# Altium schematic sheet FPGA_parts.SchDoc
size A4
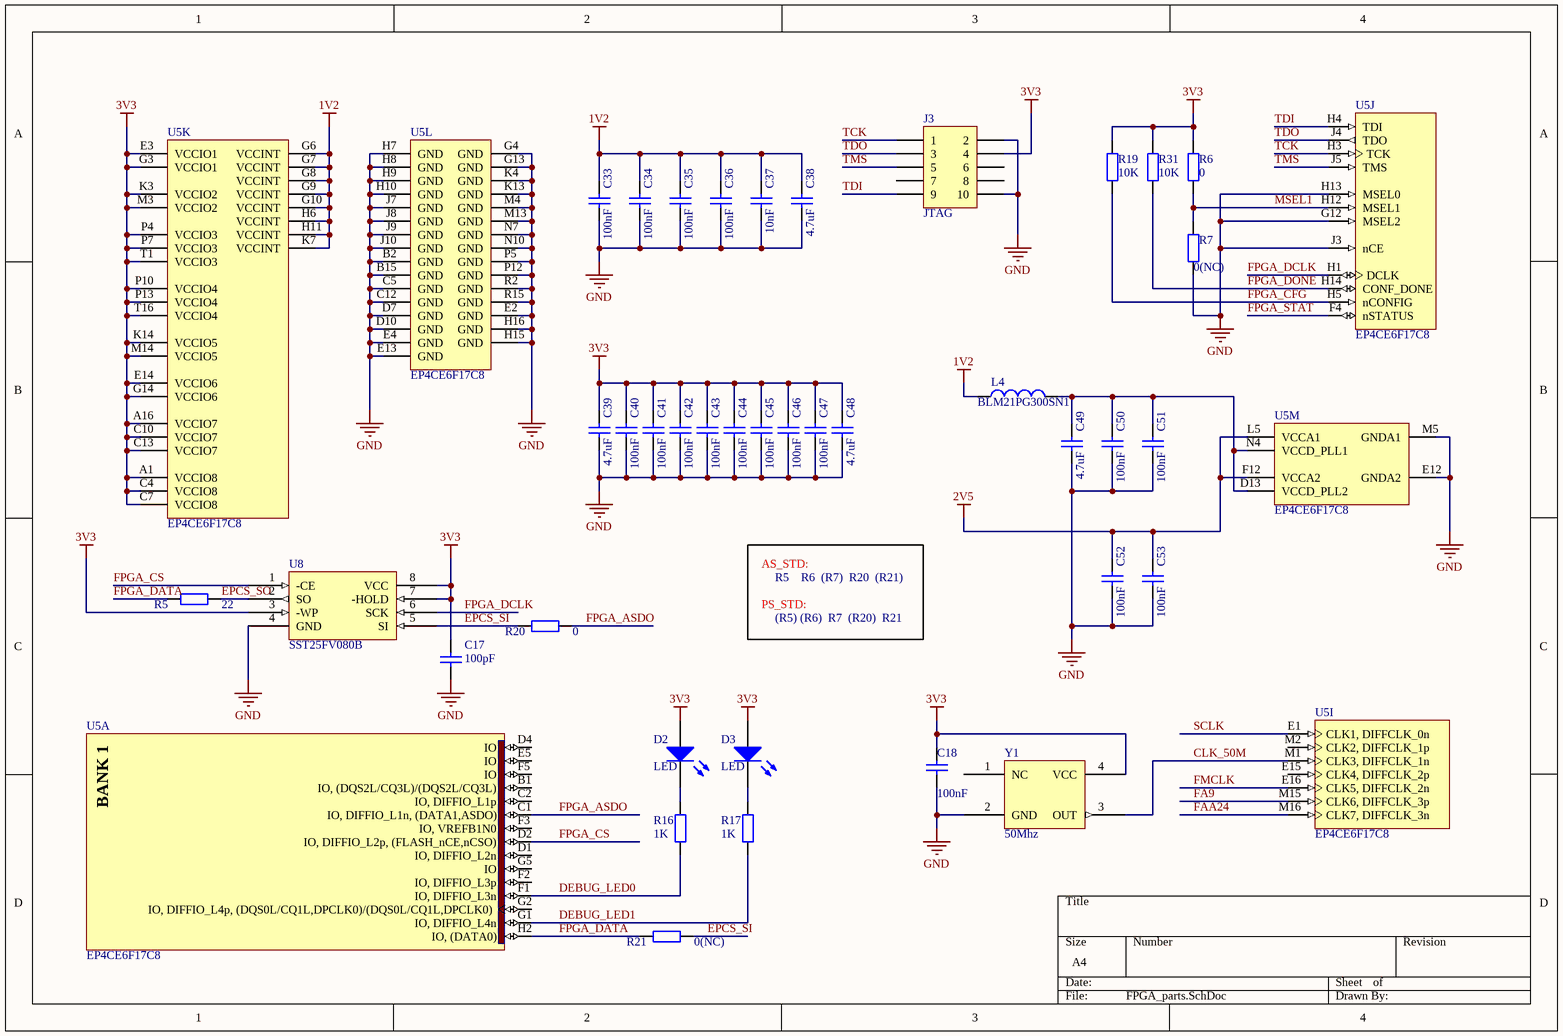
[diagram p0: FPGA_parts.SchDoc]

## Parts
C17  100pF  [C0603]
C18  100nF  [C0603]
C33  100nF  [C0603]
C34  100nF  [C0603]
C35  100nF  [C0603]
C36  100nF  [C0603]
C37  10nF  [C0603]
C38  4.7uF  [C0603]
C39  4.7uF  [C0603]
C40  100nF  [C0603]
C41  100nF  [C0603]
C42  100nF  [C0603]
C43  100nF  [C0603]
C44  100nF  [C0603]
C45  100nF  [C0603]
C46  100nF  [C0603]
C47  100nF  [C0603]
C48  4.7uF  [C0603]
C49  4.7uF  [C0603]
C50  100nF  [C0603]
C51  100nF  [C0603]
C52  100nF  [C0603]
C53  100nF  [C0603]
D2  LED  [D0603]
D3  LED  [D0603]
J3  JTAG  [HDR2X5]
L4  BLM21PG300SN1  [R0805]
R5  22  [R0603]
R6  0  [R0603]
R7  0(NC)  [R0603]
R16  1K  [R0603]
R17  1K  [R0603]
R19  10K  [R0603]
R20  0  [R0603]
R21  0(NC)  [R0603]
R31  10K  [R0603]
U5  EP4CE6F17C8  [FBGA256]  (parts A,I,J,K,L,M of 13)
U8  SST25FV080B  [SOIC-8]
Y1  50Mhz  [OSC_5032]

## Nets
1V2: C33.2 C34.2 C35.2 C36.2 C37.2 C38.2 L4.1 U5.G6(VCCINT) U5.G7(VCCINT) U5.G8(VCCINT) U5.G9(VCCINT) U5.G10(VCCINT) U5.H6(VCCINT) U5.H11(VCCINT) U5.K7(VCCINT)
2V5: C52.2 C53.2 U5.F12(VCCA2) U5.L5(VCCA1)
3V3: C17.2 C18.2 C39.2 C40.2 C41.2 C42.2 C43.2 C44.2 C45.2 C46.2 C47.2 C48.2 D2.1 D3.1 J3.4 R6.2 R19.2 R31.2 U5.A1(VCCIO8) U5.A16(VCCIO7) U5.C4(VCCIO8) U5.C7(VCCIO8) U5.C10(VCCIO7) U5.C13(VCCIO7) U5.E3(VCCIO1) U5.E14(VCCIO6) U5.G3(VCCIO1) U5.G14(VCCIO6) U5.K3(VCCIO2) U5.K14(VCCIO5) U5.M3(VCCIO2) U5.M14(VCCIO5) U5.P4(VCCIO3) U5.P7(VCCIO3) U5.P10(VCCIO4) U5.P13(VCCIO4) U5.T1(VCCIO3) U5.T16(VCCIO4) U8.3(-WP) U8.7(-HOLD) U8.8(VCC) Y1.4(VCC)
GND: C17.1 C18.1 C33.1 C34.1 C35.1 C36.1 C37.1 C38.1 C39.1 C40.1 C41.1 C42.1 C43.1 C44.1 C45.1 C46.1 C47.1 C48.1 C49.1 C50.1 C51.1 C52.1 C53.1 J3.2 J3.10 R7.1 U5.B2(GND) U5.B15(GND) U5.C5(GND) U5.C12(GND) U5.D7(GND) U5.D10(GND) U5.E2(GND) U5.E4(GND) U5.E12(GNDA2) U5.E13(GND) U5.G4(GND) U5.G12(MSEL2) U5.G13(GND) U5.H7(GND) U5.H8(GND) U5.H9(GND) U5.H10(GND) U5.H13(MSEL0) U5.H15(GND) U5.H16(GND) U5.J3(nCE) U5.J7(GND) U5.J8(GND) U5.J9(GND) U5.J10(GND) U5.K4(GND) U5.K13(GND) U5.M4(GND) U5.M5(GNDA1) U5.M13(GND) U5.N7(GND) U5.N10(GND) U5.P5(GND) U5.P12(GND) U5.R2(GND) U5.R15(GND) U8.4(GND) Y1.2(GND)
CLK_50M: U5.M1(CLK3,_DIFFCLK_1n) Y1.3(OUT)
DEBUG_LED0: R16.1 U5.F1(IO,_DIFFIO_L3n)
DEBUG_LED1: R17.1 U5.G1(IO,_DIFFIO_L4n)
EPCS_SI: R20.1 R21.2 U8.5(SI)
EPCS_SO: R5.2 U8.2(SO)
FA9: U5.M15(CLK6,_DIFFCLK_3p)
FAA24: U5.M16(CLK7,_DIFFCLK_3n)
FMCLK: U5.E16(CLK5,_DIFFCLK_2n)
FPGA_ASDO: R20.2 U5.C1(IO,_DIFFIO_L1n,_(DATA1,ASDO))
FPGA_CFG: R19.1 U5.H5(nCONFIG)
FPGA_CS: U5.D2(IO,_DIFFIO_L2p,_(FLASH_nCE,nCSO)) U8.1(-CE)
FPGA_DATA: R5.1 R21.1 U5.H2(IO,_(DATA0))
FPGA_DCLK: U5.H1(DCLK) U8.6(SCK)
FPGA_DONE: R31.1 U5.H14(CONF_DONE)
FPGA_STAT: U5.F4(nSTATUS)
MSEL1: R6.1 R7.2 U5.H12(MSEL1)
SCLK: U5.E1(CLK1,_DIFFCLK_0n)
TCK: J3.1 U5.H3(TCK)
TDI: J3.9 U5.H4(TDI)
TDO: J3.3 U5.J4(TDO)
TMS: J3.5 U5.J5(TMS)
NetC49_2: C49.2 C50.2 C51.2 L4.2 U5.D13(VCCD_PLL2) U5.N4(VCCD_PLL1)
NetD2_2: D2.2 R16.2
NetD3_2: D3.2 R17.2

Not connected (* = marked no-connect by the designer): J3 6 7 8; U5 B1(IO,_(DQS2L/CQ3L)/(DQS2L/CQ3L)) C2(IO,_DIFFIO_L1p) D1(IO,_DIFFIO_L2n) D4(IO) E5(IO) E15(CLK4,_DIFFCLK_2p) F2(IO,_DIFFIO_L3p) F3(IO,_VREFB1N0) F5(IO) G2(IO,_DIFFIO_L4p,_(DQS0L/CQ1L,DPCLK0)/(DQS0L/CQ1L,DPCLK0)) G5(IO) M2(CLK2,_DIFFCLK_1p); Y1 1(NC)

## Notes on the sheet
- AS_STD:
- R5    R6  (R7)  R20  (R21)
- PS_STD:
- (R5) (R6)  R7  (R20)  R21
- (in symbol EP4CE6F17C8, part A) BANK 1

## Library data of the parts
C17 C18 C33-C53 = Cap: Capacitor; Published: 8-Jun-2000; LatestRevisionDate: 17-Jul-2002; LatestRevisionNote: Re-released for DXP Platform.; PackageReference: RAD-0.3; Publisher: Altium Limited
D2 D3 = LED1: Typical RED GaAs LED; Published: 8-Jun-2000; LatestRevisionDate: 08-Jul-2005; LatestRevisionNote: Mech Layer 1 removed.; PackageReference: LED-1; Publisher: Altium Limited
J3 = Header 5X2: Header, 5-Pin, Dual row; LatestRevisionDate: 17-Jul-2002; LatestRevisionNote: Re-released for DXP Platform.; Publisher: Altium Limited
L4 = Inductor: Code_IEC: 1005; Published: 8-Jun-2000; LatestRevisionDate: 17-Jul-2002; LatestRevisionNote: Re-released for DXP Platform.; PackageReference: 0402-A; Publisher: Altium Limited; Code_JEITA: 0402
R5-R7 R16 R17 R19-R21 R31 = Res2: Resistor; Published: 8-Jun-2000; LatestRevisionDate: 17-Jul-2002; LatestRevisionNote: Re-released for DXP Platform.; PackageReference: AXIAL-0.4; Publisher: Altium Limited
U5 = EP4CE6F17C8: Cyclone IV Family FPGA, 2V Core, 179 I/O Pins, 2 PLLs, 256-Pin FBGA, Speed Grade 8, Commercial Grade; Published: 3-May-2010; DatasheetVersion: ver1.2, Mar-2010; PackageVersion: ver16.0, Dec-2009; PackageReference: FBGA256; Publisher: Altium Limited; PackageDescription: 256-Ball FineLine Ball Grid Array (FBGA256) - Option 1 - Wire Bond; Code_JEDEC: MS-034-AAF-1; Code_IPC: BGA100P16X16-256; ComponentLink1Description: Manufacturer Link; ComponentLink1URL: http://www.altera.com/; ComponentLink2Description: Handbook; ComponentLink2URL: http://www.altera.com/literature/hb/cyclone-iv/cyclone4-handbook.pdf; ComponentLink3Description: Pinout Specification; ComponentLink3URL: http://www.altera.com/literature/lit-dp.jsp?category=cyc%204&showspreadsheet=y; ComponentLink4Description: Packaging Specification; ComponentLink4URL: http://www.altera.com/literature/ds/dspkg.pdf
Y1 = JZSMD5X7